# EasyEDA schematic HolaBot.json
TITLE: HolaBot PCB; REV: 1.0; Date: 2023-12-06; Sheet: 1/1; Company: IIT Dhanbad
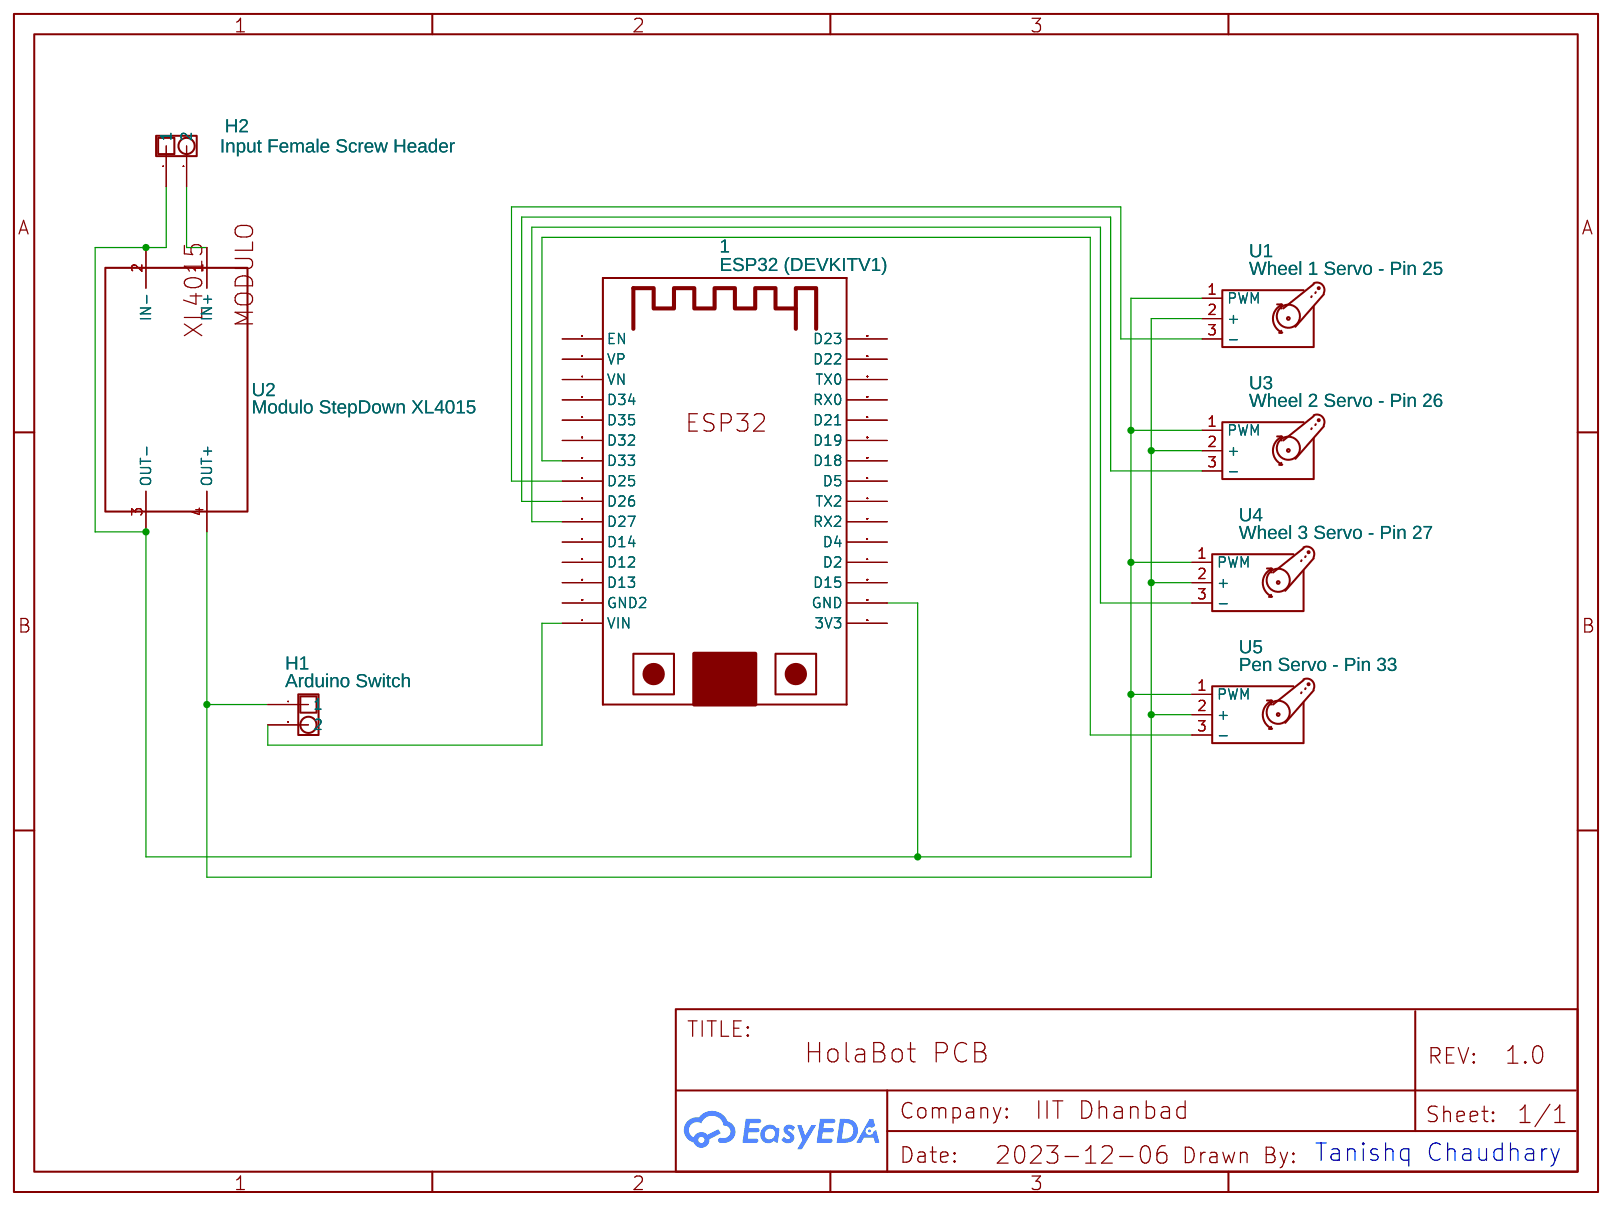
[diagram p0: schematic sheet]

## Parts
1  ESP32 (DEVKITV1)  [ESP32-DEVKITV1_ESP32-DEVKITV1]
H1  Arduino Switch  [1X02 2.54MM HOLES HEADERS PINS 1MM HOLES]
H2  Input Female Screw Header  [1X02 2.54MM HOLES HEADERS PINS 1MM HOLES]
U1  Wheel 1 Servo - Pin 25  [KKTL-MOTOR-SERVO-01]
U2  Modulo StepDown XL4015  [XL4015-5A-MODULE]
U3  Wheel 2 Servo - Pin 26  [KKTL-MOTOR-SERVO-01]
U4  Wheel 3 Servo - Pin 27  [KKTL-MOTOR-SERVO-01]
U5  Pen Servo - Pin 33  [KKTL-MOTOR-SERVO-01]

## Library data of the parts
1 = ESP32-DEVKIT-V1-30PIN: Contributor: jagils
H1 H2 = Header pins 1x02 1MM HOLES: Contributor: Cameron102
U1 U3-U5 = KKTL-MOTOR-SERVO-01 COPY: Contributor: kakatuland
U2 = Modulo StepDown XL4015: Contributor: Luis Tapia

## Nets
Net-(1-D25): 1.D25 U1.3(-)
Net-(1-D26): 1.D26 U3.3(-)
Net-(1-D27): 1.D27 U4.3(-)
Net-(1-D33): 1.D33 U5.3(-)
Net-(1-GND): 1.GND H2.1 U1.1(PWM) U2.2(IN-) U2.3(OUT-) U3.1(PWM) U4.1(PWM) U5.1(PWM)
Net-(1-VIN): 1.VIN H1.2
Net-(H1-1): H1.1 U1.2(+) U2.4(OUT+) U3.2(+) U4.2(+) U5.2(+)
Net-(H2-2): H2.2 U2.1(IN+)

Not connected (* = marked no-connect by the designer): 1 3V3 D2 D4 D5 D12 D13 D14 D15 D18 D19 D21 D22 D23 D32 D34 D35 EN GND2 RX0 RX2 TX0 TX2 VN VP

## Notes on the sheet
- Tanishq Chaudhary
